# Altium schematic sheet USB.SchDoc
size A4; SheetNumber: 2; SheetTotal: 3
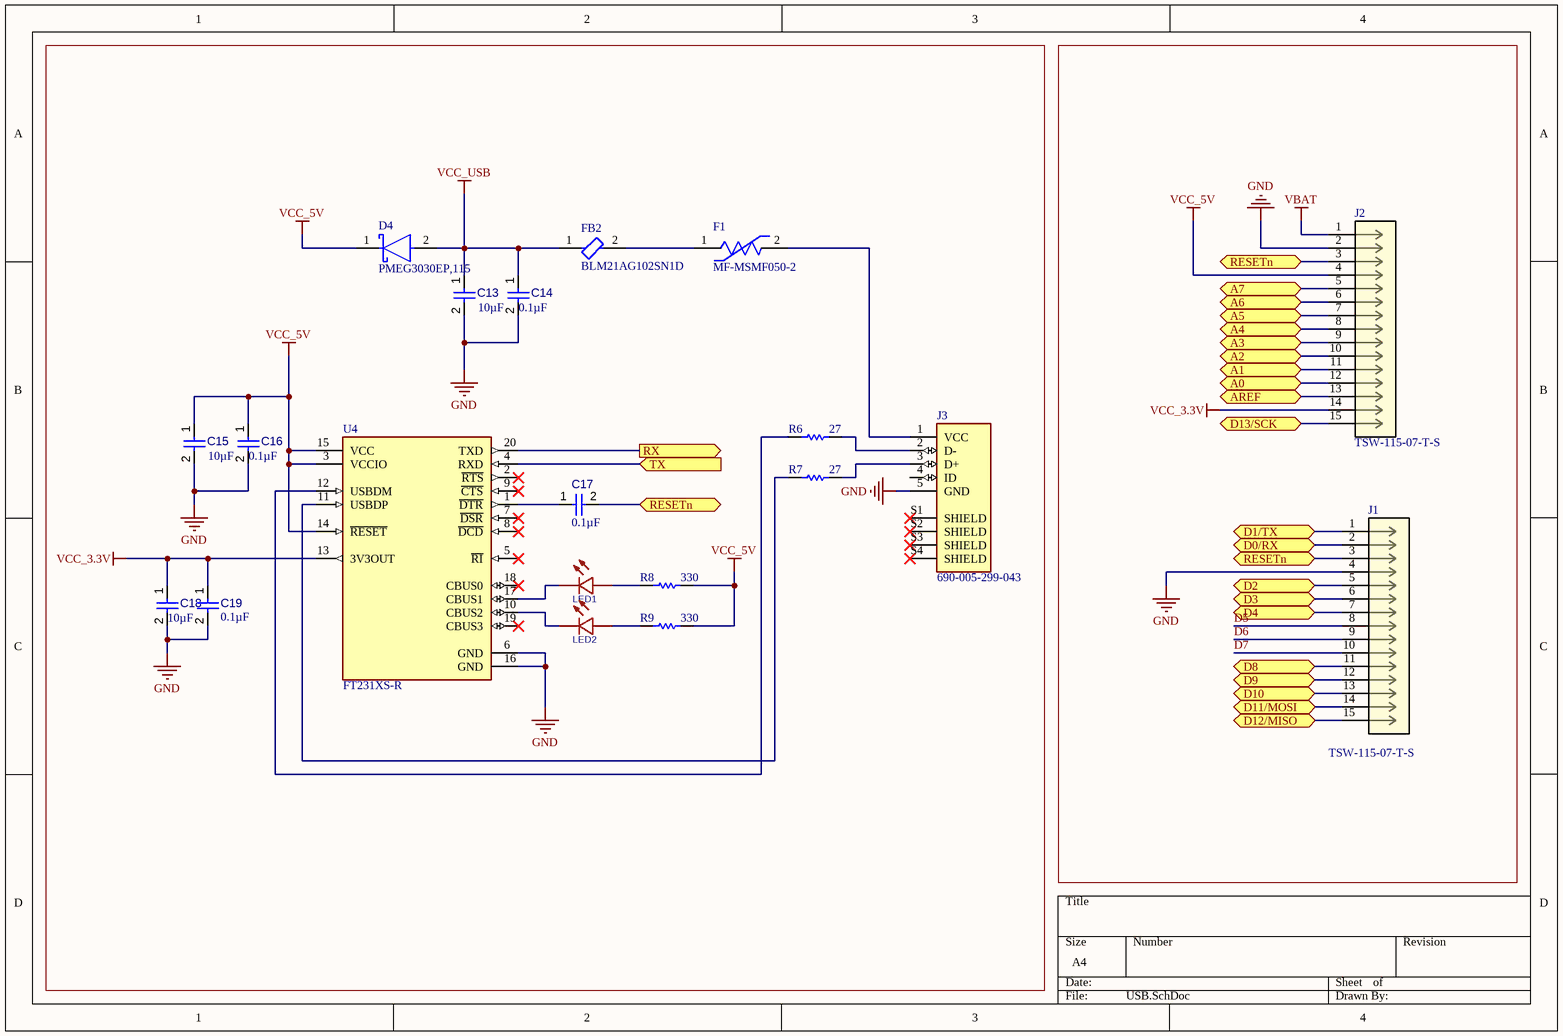
[diagram p0: USB.SchDoc]

## Parts
C13  value 10µF  [CAPC2013X135X45NL10T25]  (hidden comment: Capacitor 10 uF +/- 10% 16 V 0805)
C14  value 0.1µF  [CAPC2013X135X45NL10T25]  (hidden comment: Capacitor 10 uF +/- 10% 16 V 0805)
C15  value 10µF  [CAPC2013X135X45NL10T25]  (hidden comment: Capacitor 10 uF +/- 10% 16 V 0805)
C16  value 0.1µF  [CAPC2013X135X45NL10T25]  (hidden comment: Capacitor 10 uF +/- 10% 16 V 0805)
C17  value 0.1µF  [CAPC2013X135X45NL10T25]  (hidden comment: Capacitor 10 uF +/- 10% 16 V 0805)
C18  value 10µF  [CAPC2013X135X45NL10T25]  (hidden comment: Capacitor 10 uF +/- 10% 16 V 0805)
C19  value 0.1µF  [CAPC2013X135X45NL10T25]  (hidden comment: Capacitor 10 uF +/- 10% 16 V 0805)
D4  PMEG3030EP,115  [FP-SOD128-MFG]
F1  MF-MSMF050-2  [FP-MF-MSMF050-2-MFG]
FB2  BLM21AG102SN1D  [FP-BLM21-0_2-t0_85-e0_5-MFG]
J1  TSW-115-07-T-S  [CON15_1X15_TU_TSW]
J2  TSW-115-07-T-S  [CON15_1X15_TU_TSW]
J3  690-005-299-043  [690-005-299-043_EDA]
LED1  FC-DA1608HRK-620D  [LED0603-RD_RED]  (value not drawn)
LED2  FC-DA1608HRK-620D  [LED0603-RD_RED]  (value not drawn)
R6  value 27  [RESC2013X50X35ML15T15]  (hidden comment: Resistor 0R +/- 1% 0805 125 mW)
R7  value 27  [RESC2013X50X35ML15T15]  (hidden comment: Resistor 0R +/- 1% 0805 125 mW)
R8  value 330  [RESC2013X50X35ML15T15]  (hidden comment: Resistor 0R +/- 1% 0805 125 mW)
R9  value 330  [RESC2013X50X35ML15T15]  (hidden comment: Resistor 0R +/- 1% 0805 125 mW)
U4  FT231XS-R  [FP-SSOP-20-MFG]

## Ports
A0 (bidir, see Simon_game[2C]), A1 (bidir, see Simon_game[2C]), A2 (bidir, see buttons_audio_amplifier[3A], Simon_game[2C]), A3 (bidir, see buttons_audio_amplifier[3A], Simon_game[2C]), A4 (bidir, see Simon_game[2C]), A5 (bidir, see Simon_game[2C]), A6 (bidir, see buttons_audio_amplifier[3B], Simon_game[2C]), A7 (bidir, see buttons_audio_amplifier[3B], Simon_game[2C]), AREF (bidir, see Simon_game[1C], Simon_game[2B]), D0/RX (bidir, see Simon_game[2B], Simon_game[2C]), D1/TX (bidir, see Simon_game[2B], Simon_game[2C]), D2 (bidir, see Simon_game[2C]), D3 (bidir, see Simon_game[2C]), D4 (bidir, see Simon_game[2C]), D8 (bidir, see buttons_audio_amplifier[4C], Simon_game[2D]), D9 (bidir, see buttons_audio_amplifier[1C], Simon_game[2D]), D10 (bidir, see Simon_game[2D]), D11/MOSI (bidir, see Simon_game[2D], Simon_game[4D]), D12/MISO (bidir, see Simon_game[2D], Simon_game[3D]), D13/SCK (bidir, see Simon_game[2D], Simon_game[3C], Simon_game[3D]), RESETn (bidir, see Simon_game[2C], Simon_game[3D], Simon_game[4B], USB[2B], USB[4B]), RESETn (bidir, see Simon_game[2C], Simon_game[3D], Simon_game[4B], USB[2B], USB[4C]), RESETn (bidir, see Simon_game[2C], Simon_game[3D], Simon_game[4B], USB[4B], USB[4C]), RX (out, see Simon_game[3B]), TX (in, see Simon_game[3B])

## Nets
GND: C13.2 C14.2 C15.2 C16.2 C18.2 C19.2 J1.4 J2.2 J3.5(GND) U4.6(GND) U4.16(GND)
VBAT: J2.1
VCC_3.3V: C18.1 C19.1 J2.14 U4.13(3V3OUT)
VCC_5V: C15.1 C16.1 D4.1(C) J2.4 R8.2 R9.2 U4.3(VCCIO) U4.14(~{RESET}) U4.15(VCC)
VCC_USB: C13.1 C14.1 D4.2(A) FB2.1
A0: J2.12 ; port A0
A1: J2.11 ; port A1
A2: J2.10 ; port A2
A3: J2.9 ; port A3
A4: J2.8 ; port A4
A5: J2.7 ; port A5
A6: J2.6 ; port A6
A7: J2.5 ; port A7
AREF: J2.13 ; port AREF
D0/RX: J1.2 ; port D0/RX
D1/TX: J1.1 ; port D1/TX
D2: J1.5 ; port D2
D3: J1.6 ; port D3
D4: J1.7 ; port D4
D5: J1.8
D6: J1.9
D7: J1.10
D8: J1.11 ; port D8
D9: J1.12 ; port D9
D10: J1.13 ; port D10
D11/MOSI: J1.14 ; port D11/MOSI
D12/MISO: J1.15 ; port D12/MISO
D13/SCK: J2.15 ; port D13/SCK
RESETn: C17.2 J1.3 J2.3 ; port RESETn
RX: U4.20(TXD) ; port RX
TX: U4.4(RXD) ; port TX
NetC17_1: C17.1 U4.1(~{DTR})
NetF1_1: F1.1 FB2.2
NetF1_2: F1.2 J3.1(VCC)
NetJ3_2: J3.2(D-) R6.2
NetJ3_3: J3.3(D+) R7.2
NetLED1_1: LED1.1(K) U4.17(CBUS1)
NetLED1_2: LED1.2(A) R8.1
NetLED2_1: LED2.1(K) U4.10(CBUS2)
NetLED2_2: LED2.2(A) R9.1
NetR6_1: R6.1 U4.12(USBDM)
NetR7_1: R7.1 U4.11(USBDP)

Not connected (* = marked no-connect by the designer): J3 4(ID) S1(SHIELD)* S2(SHIELD)* S3(SHIELD)* S4(SHIELD)*; U4 2(~{RTS})* 5(~{RI})* 7(~{DSR})* 8(~{DCD})* 9(~{CTS})* 18(CBUS0)* 19(CBUS3)*

## Library data of the parts
C13-C19 = CMP-001-00015-6: Chip Capacitor, 10 uF, +/- 10%, 16 V, 0805 (2012 Metric); Voltage Rating: 16V; Capacitor Type: Ceramic; RoHS Compliant: True; Max Operating Temperature: 85°C; Min Operating Temperature: -55°C; Mounting Technology: SM; Tolerance: 10%; Case/Package: 0805; Pins: 2
D4 = CMP-14398-000052-1: DIODE SCHOTTKY 30V 3A SOD128; RoHS Compliant: Yes
F1 = CMP-2100-03653-2: PTC RESET FUSE 15V 500MA 1812; Manufacturer: Bourns; Value: 0.15-1Ω; Trip Current: 1A; Automotive Grade: Grade 3; Trip Time: 0.15s; Current Rating: 100A; Hold Current: 0.5A; Height: 0.85mm; Package: 1812; Voltage Rating: 15V; Temperature Range High: +85°C; Device Class L2: PTC Resettable Fuses; Lead Free: Yes; ComponentLink2URL: http://www.bourns.com/docs/Product-Datasheets/mfmsmf.pdf; Ambient Temperature Range High: +85°C; Mouser Description: PTC Resettable Fuse 0.5A(hold) 1A(trip) 15V 100A 0.8W 0.15s 0.15Ohm SMD Solder Pad 1812 T/R; Digikey Description: PTC RESET FUSE 15V 500MA 1812; Manufacturer Part Number: MF-MSMF050-2; Resistance: 0.15-1Ω; Category: Fuse; ComponentLink2Description: Datasheet; Automotive: Yes; Temperature Range Low: -40°C; RoHS: TRUE; Device Class L1: Circuit Protection; Temperature: -40°C to +85°C; Octopart: https://octopart.com/mf-msmf050-2-bourns-28047; Ambient Temperature Range Low: -40°C; Device Class L3: unset
FB2 = CMP-0686-00665-3: Chip Ferrite Bead, 0805, 1000Ω @ 100MHz, 0.27Ω, 25%, 600mA; Material: Steel; Number of Lines: 1; Current Rating: 500mA; Max DC Current: 200mA; Impedance: 1kR; DC Resistance (DCR): 280mR; Shielding: Unshielded; Length: 2mm; Max Current Rating: 600mA; Max Operating Temperature: 125°C; Lead Free: Lead Free; Test Frequency: 100MHz; Number of Pins: 2; Height: 0.85mm; Package Quantity: 1; Termination: SMD/SMT; Depth: 1.25mm; Radiation Hardening: No; Case Code (Metric): 2012; Tolerance: 25%; Core Material: Ferrite; Min Operating Temperature: -55°C; Case Code (Imperial): 0805; Weight: 0.000194oz; DC Current: 200mA; Case/Package: 0805; REACH SVHC: No SVHC; Frequency: 100MHz; Military Standard: Not; Number of Circuits: 1; Width: 1.25mm; Packaging: Tape and Reel
J1 J2 = TSW-115-07-T-S: No Description Available; Manufacturer_Name: Samtec Inc; Copyright: Copyright (C) 2026 Ultra Librarian. All rights reserved.; Manufacturer_Part_Number: TSW-115-07-T-S; RefDes: RefDes; Type: Type
J3 = 690-005-299-043: USB - mini B USB 2.0 Receptacle Connector 5 Position Surface Mount, Right Angle; MF: EDAC Inc.; SnapEDA_Link: https://www.snapeda.com/parts/690-005-299-043/EDAC/view-part/?ref=snap; Package: None; Value: *; MP: 690-005-299-043; Check_prices: https://www.snapeda.com/parts/690-005-299-043/EDAC/view-part/?ref=eda
R6-R9 = CMP-009-00001-5: Chip Resistor, 0 Ohm, +/- 1%, 125 mW, -55 to 155 degC, 0805 (2012 Metric); Voltage Rating: 150V; Power: 125mW; Mounting Technology: SM; Max Operating Temperature: 155°C; Case/Package: 0805; RoHS Compliant: True; Pins: 2; Min Operating Temperature: -55°C; Tolerance: 1%
U4 = CMP-0248-00024-3: IC USB SERIAL FULL UART 20SSOP; Operating Supply Voltage: 5V; Operating Supply Current: 8mA; Number of Channels: 1; Min Supply Voltage: 2.97V; Max Supply Voltage: 5.5V; Data Rate: 12Mbps; Height: 0.059inch; Packaging: Tape and Reel; Mount: Surface Mount; Package Quantity: 2000; Radiation Hardening: No; Case/Package: SSOP; Min Operating Temperature: -40°C; Width: 0.157inch; Number of Pins: 20; Weight: 0.016oz; Interface: UART; Max Operating Temperature: 85°C; Length: 8.74mm
LED1 LED2 = FC-DA1608HRK-620D: Symbol: FC-DA1608HRK-620D